# EAGLE schematic p8x-bustest-card (EAGLE 9.6.2)
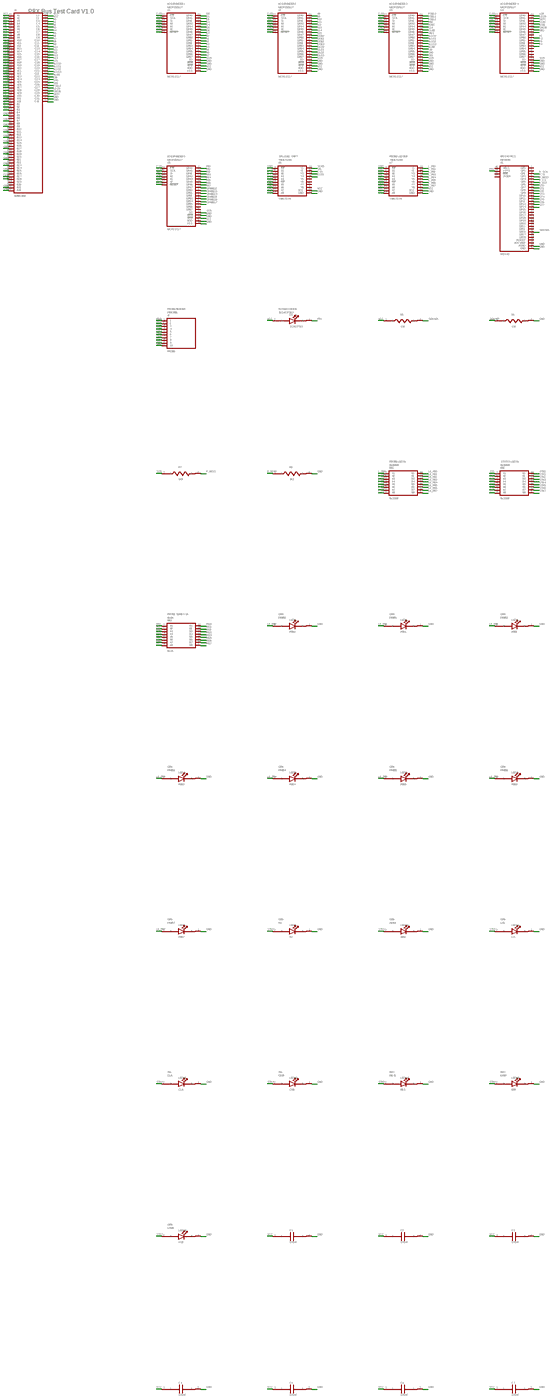
[diagram p0: schematic, sheet 1, overview]
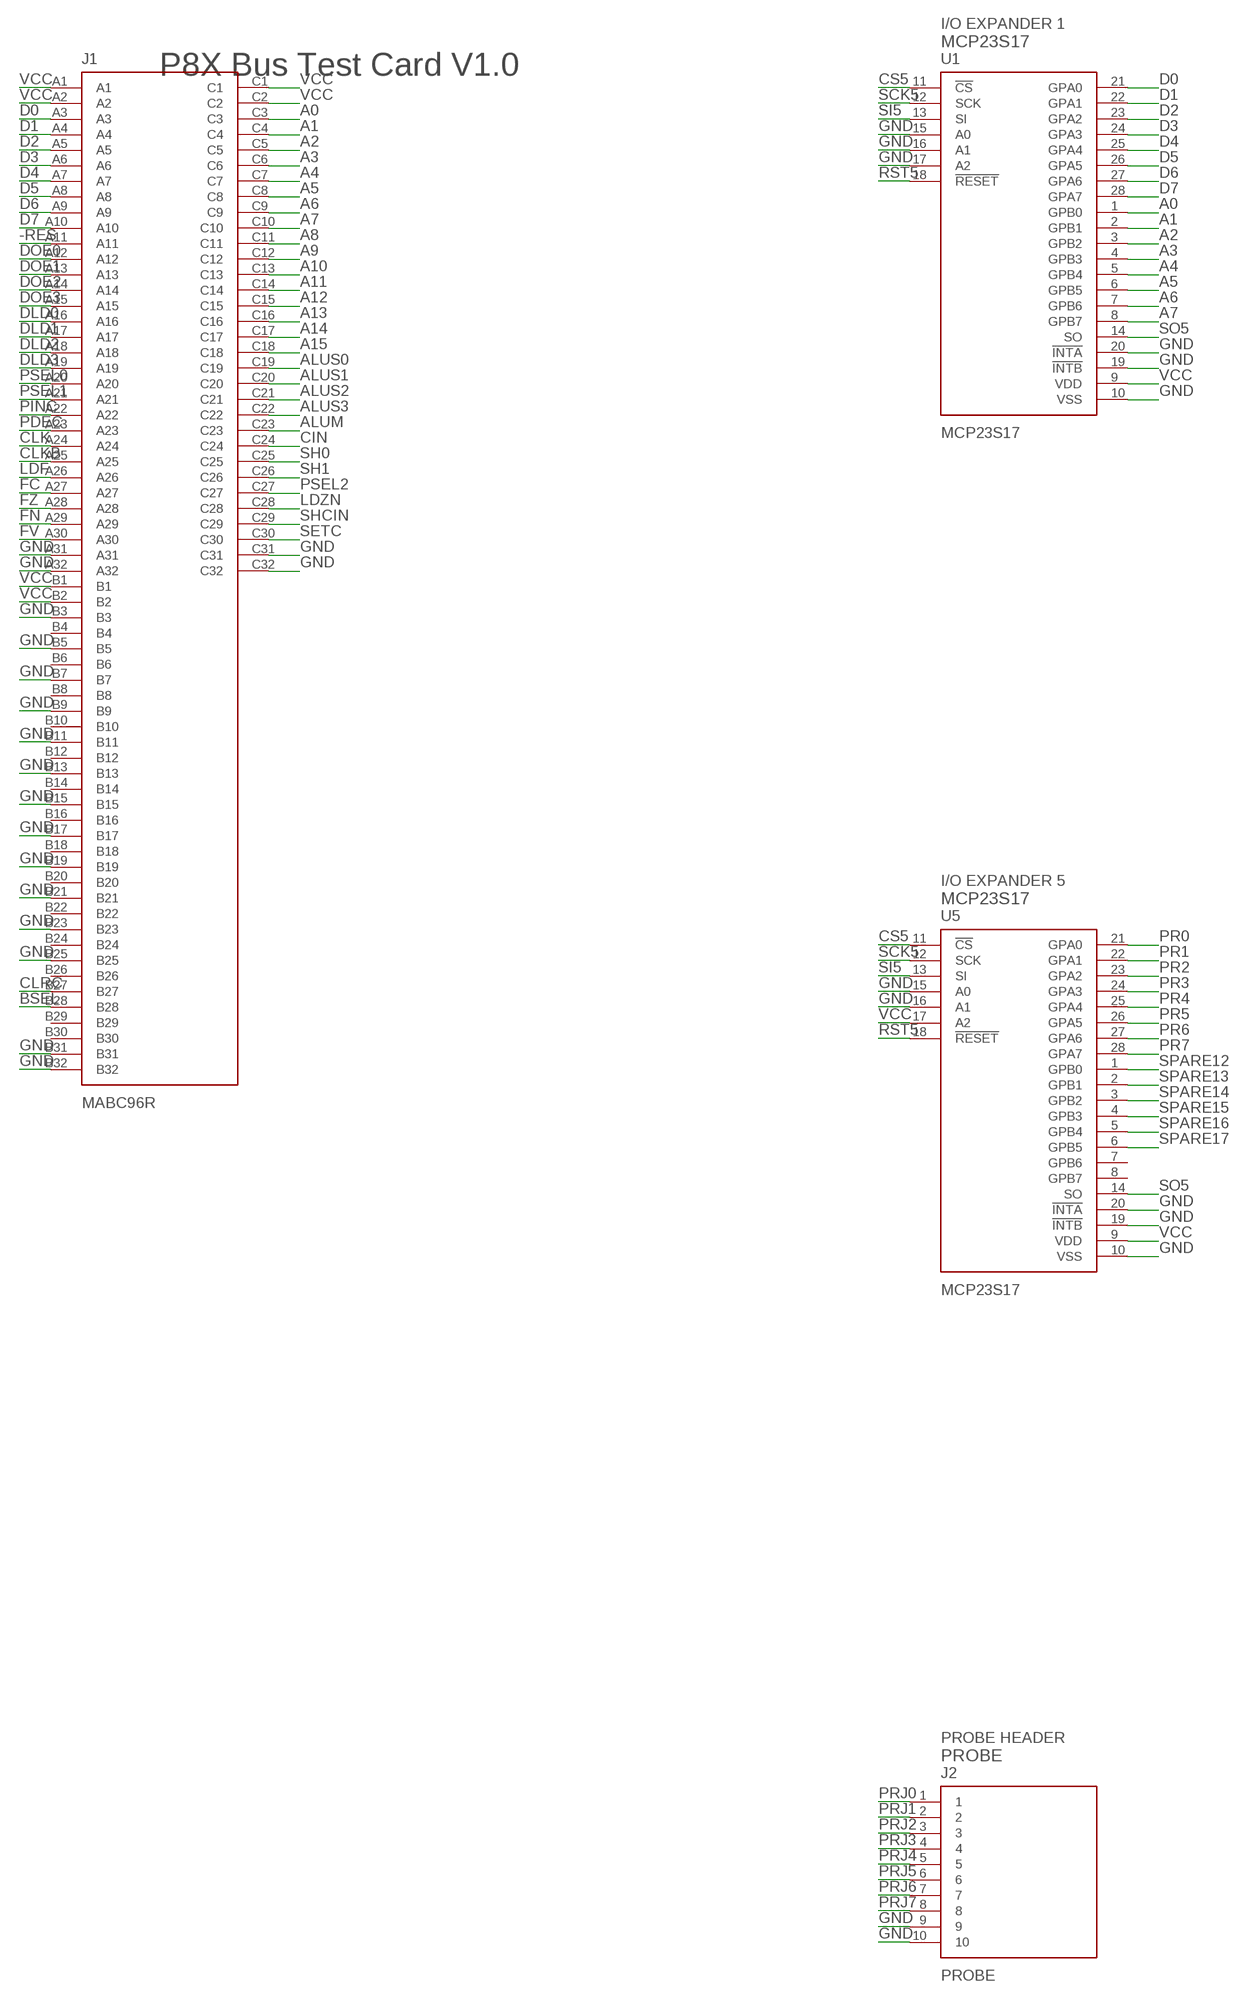
[diagram p1: schematic, sheet 1, part 1 of 5]
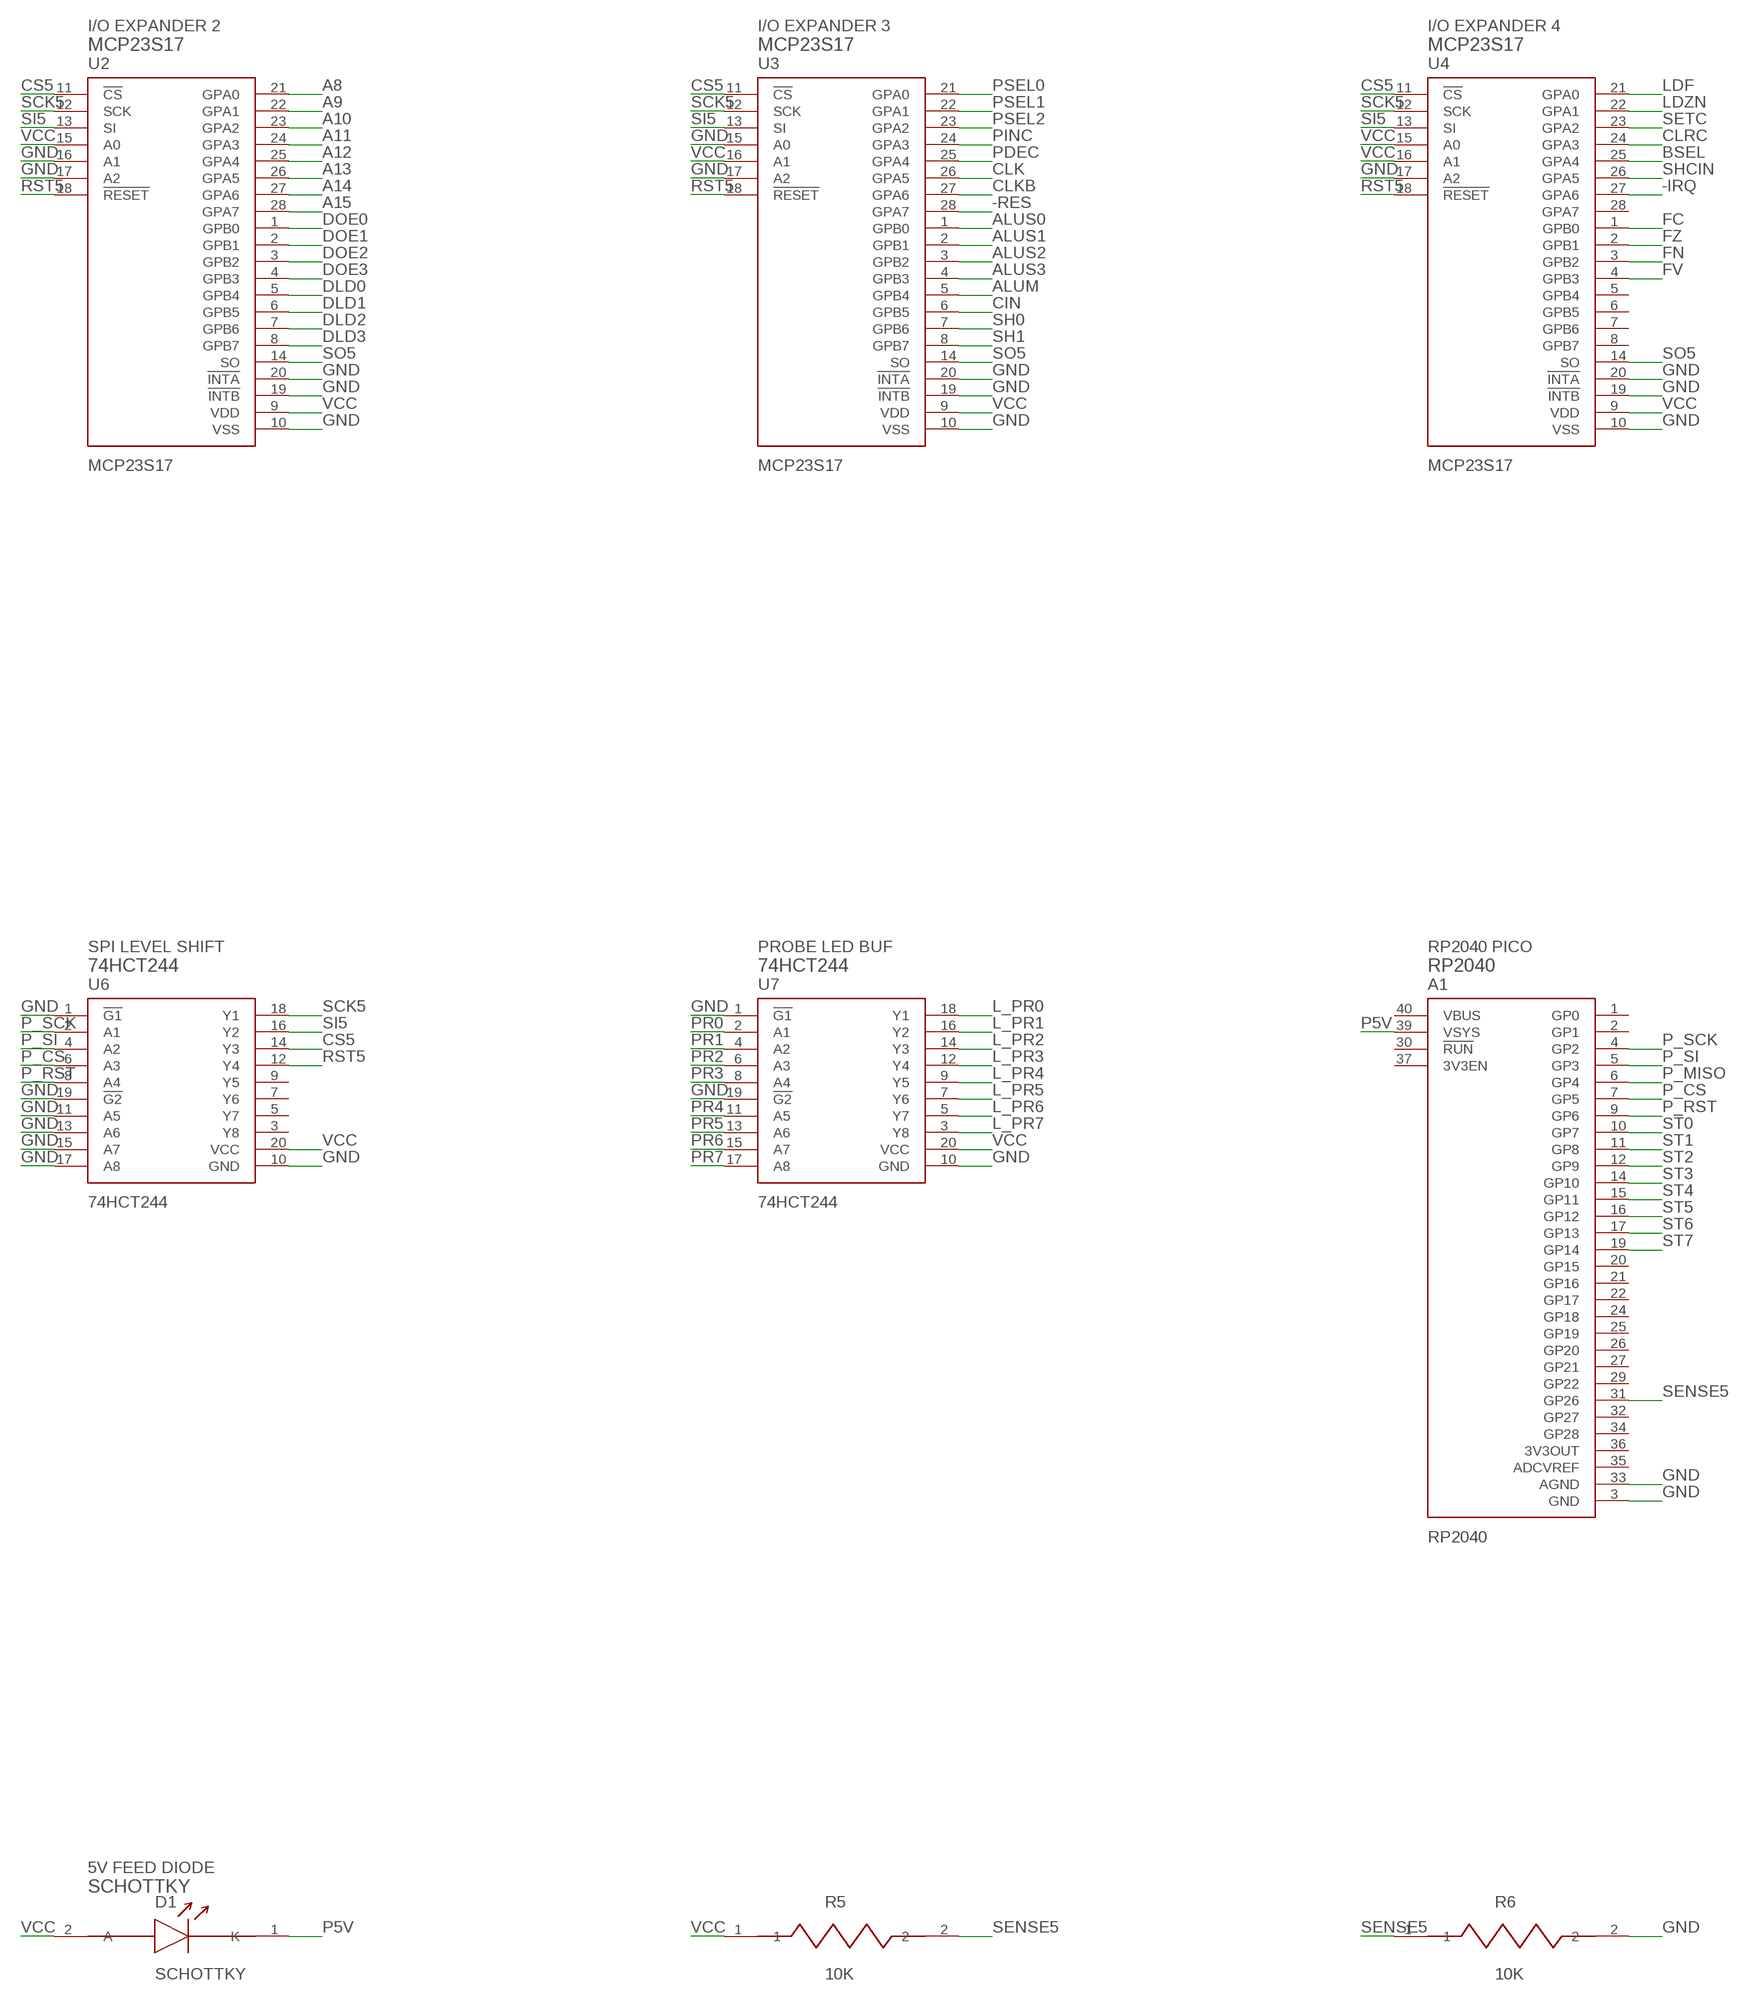
[diagram p2: schematic, sheet 1, part 2 of 5]
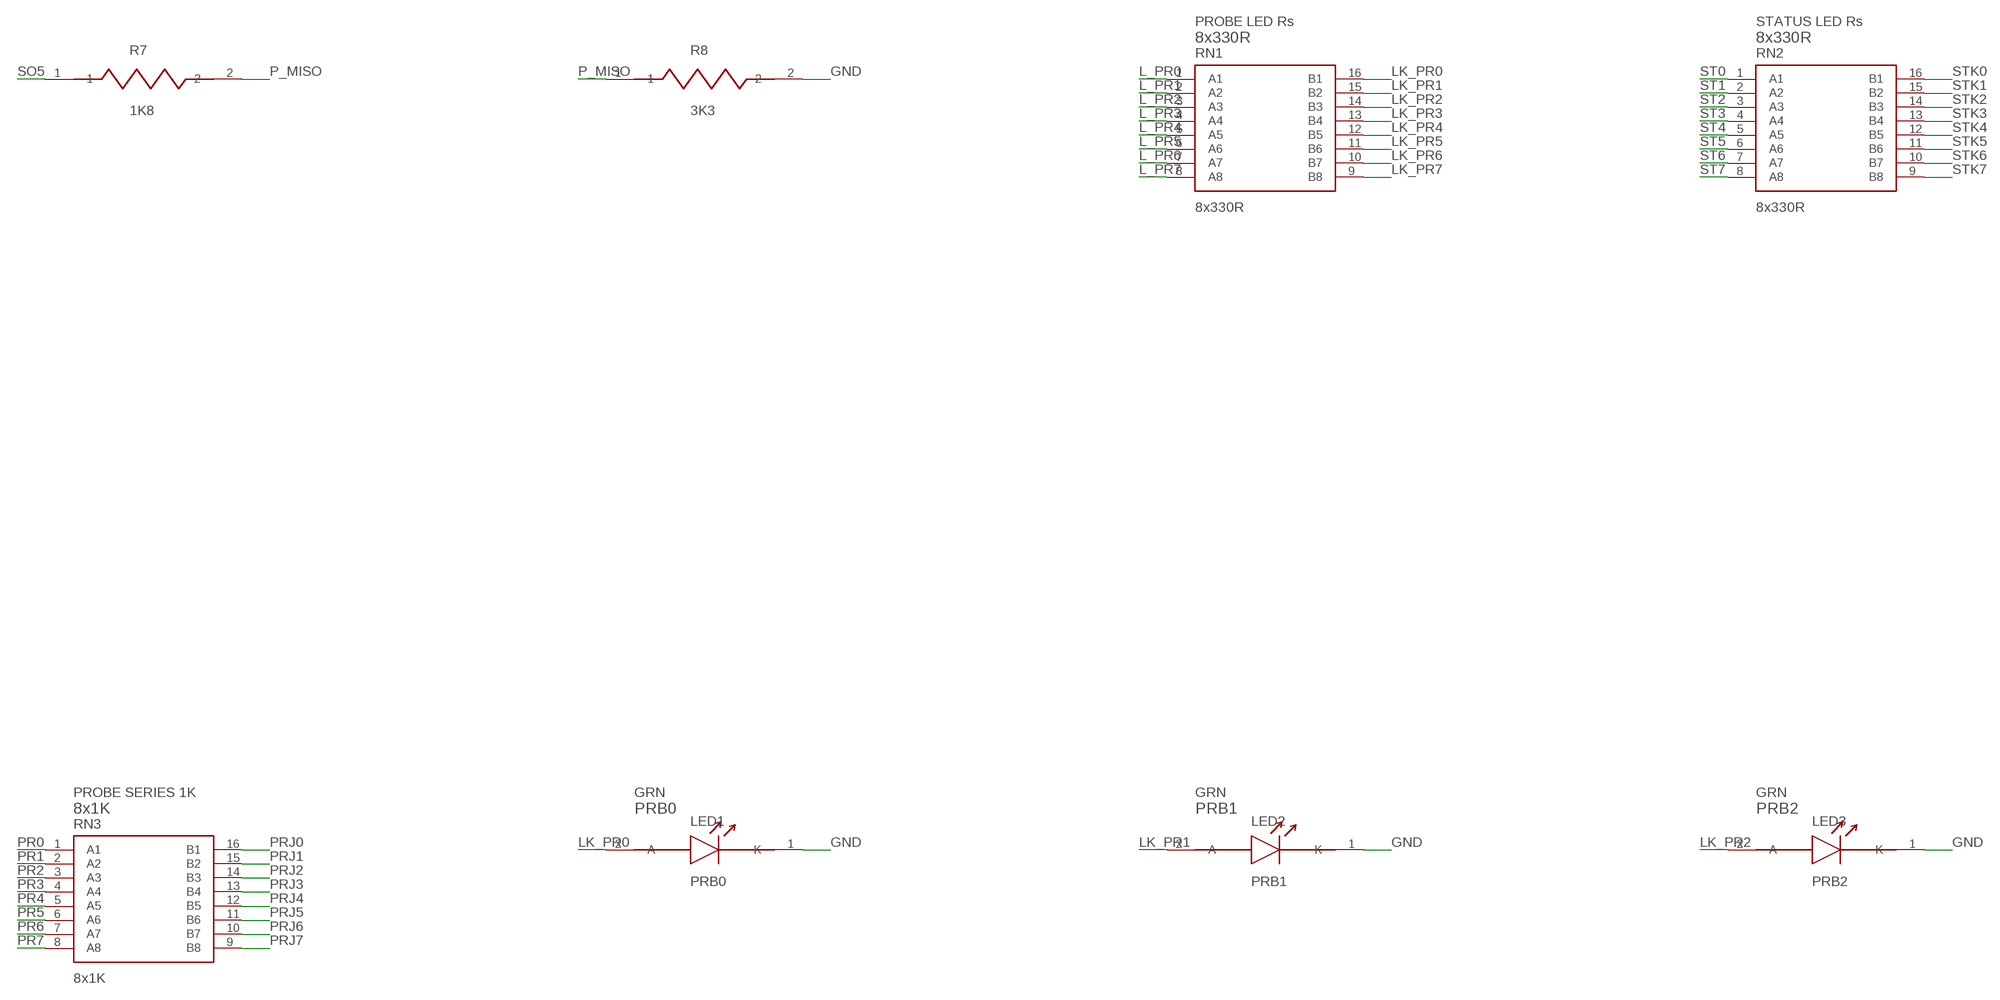
[diagram p3: schematic, sheet 1, part 3 of 5]
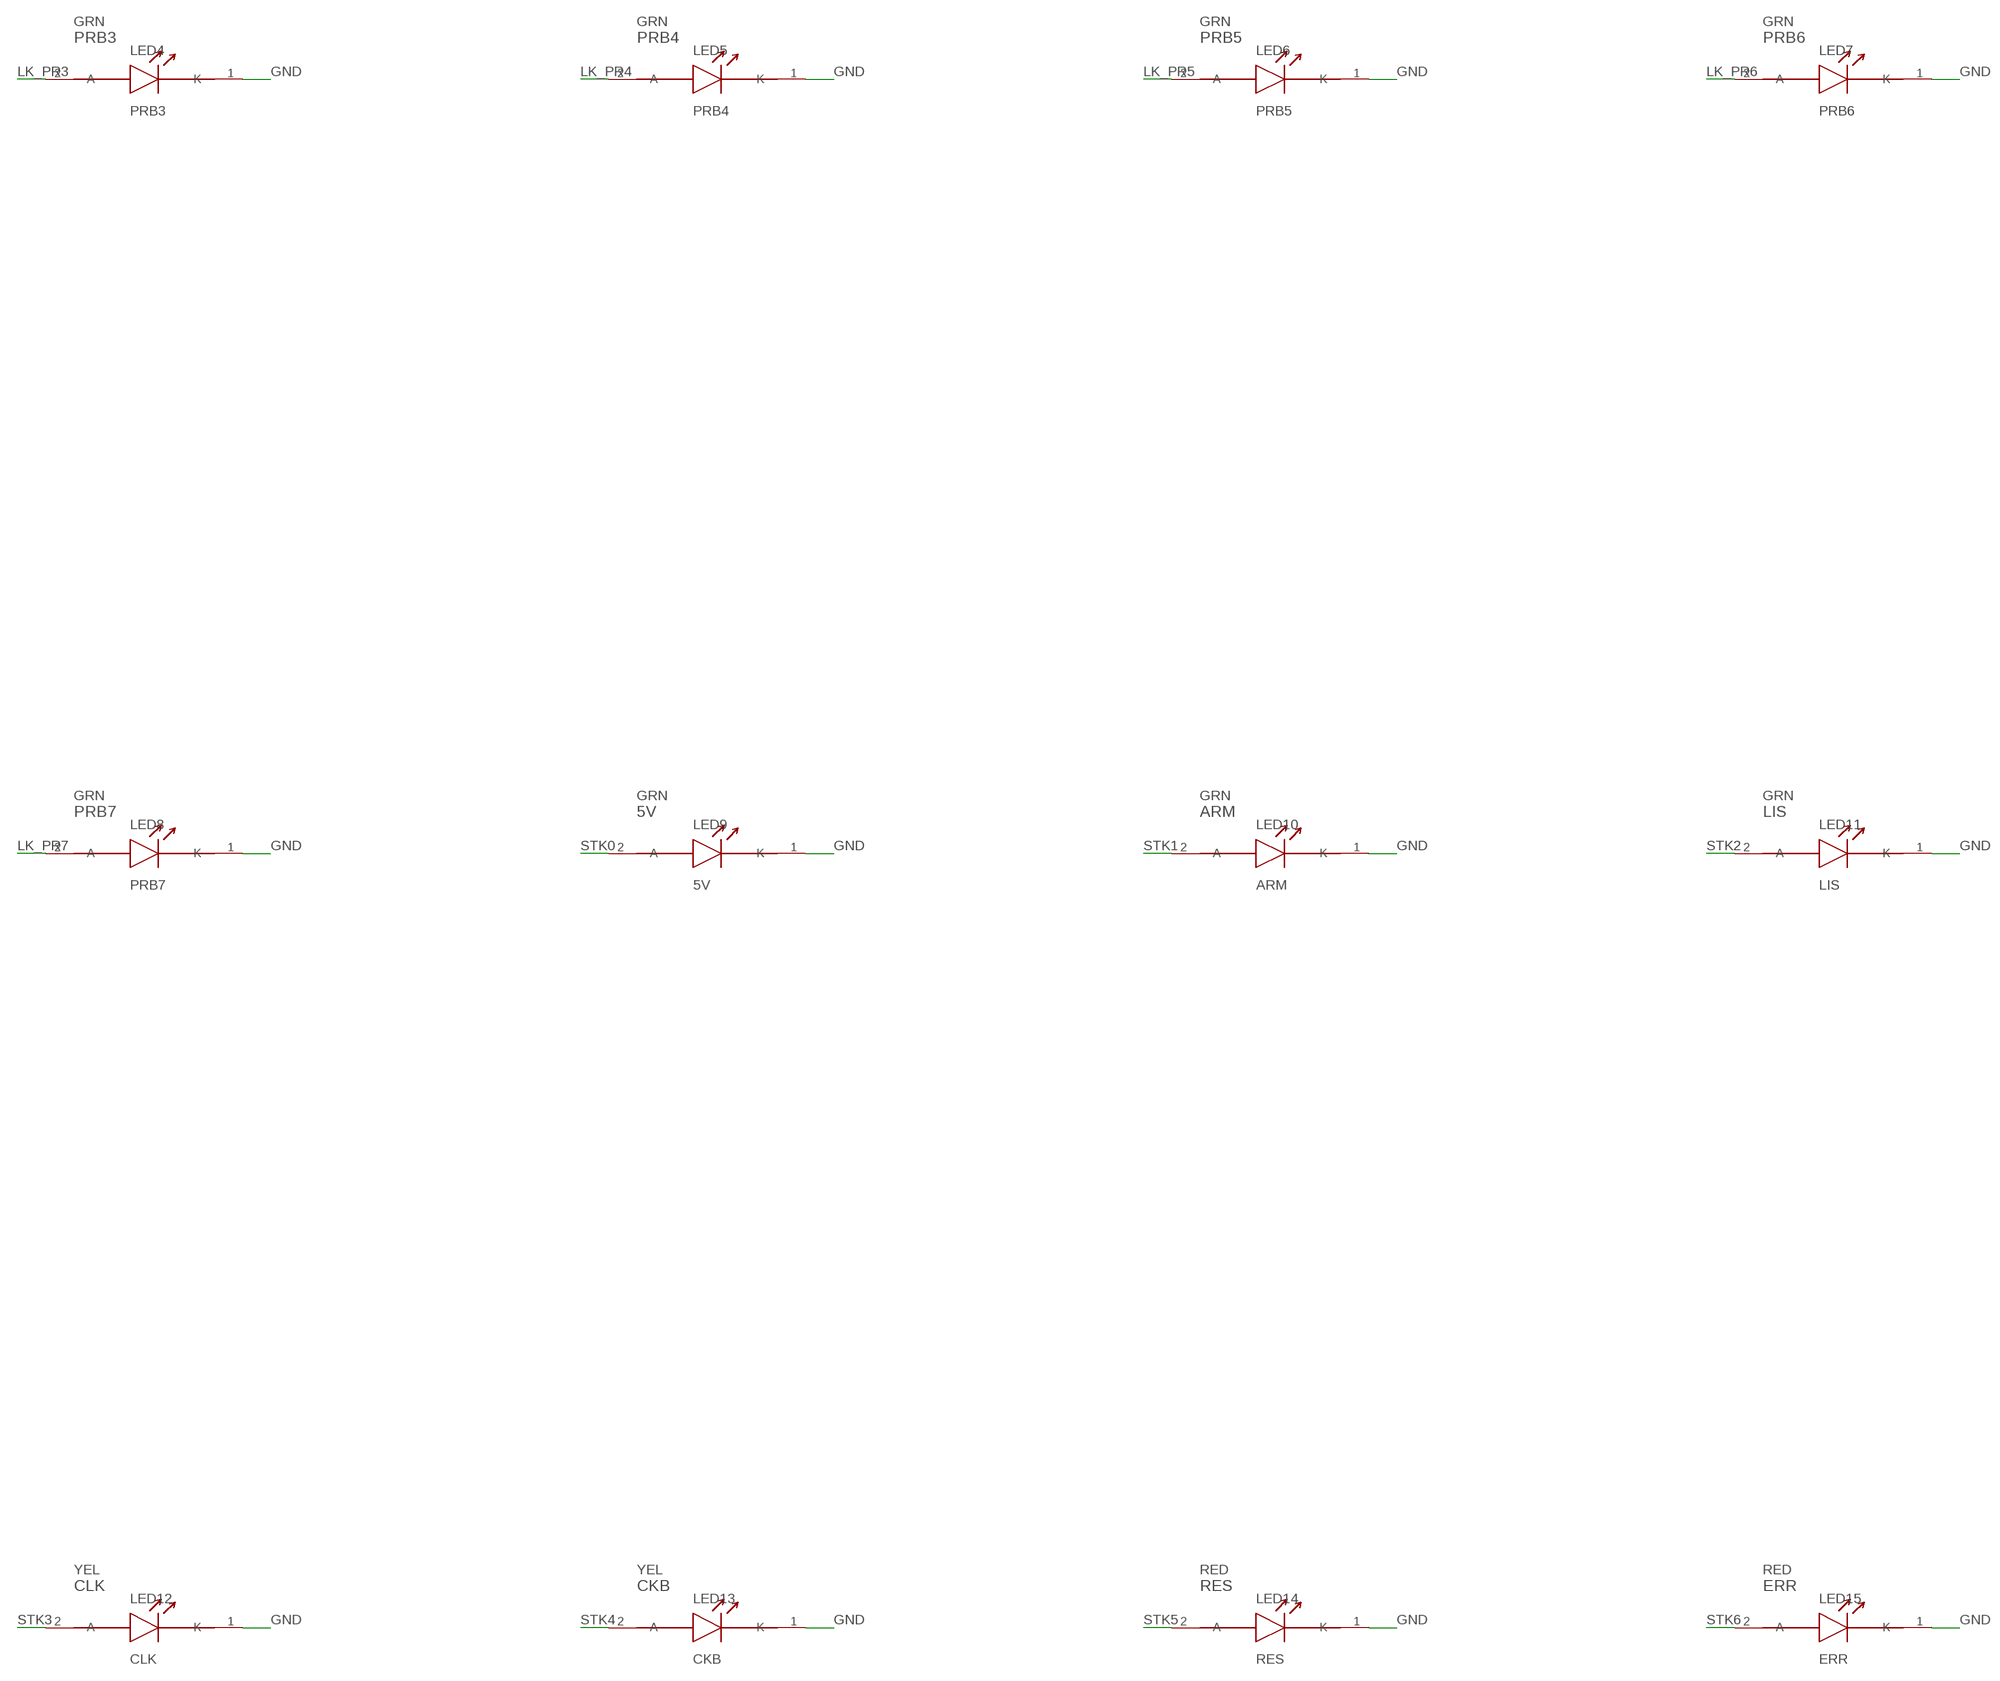
[diagram p4: schematic, sheet 1, part 4 of 5]
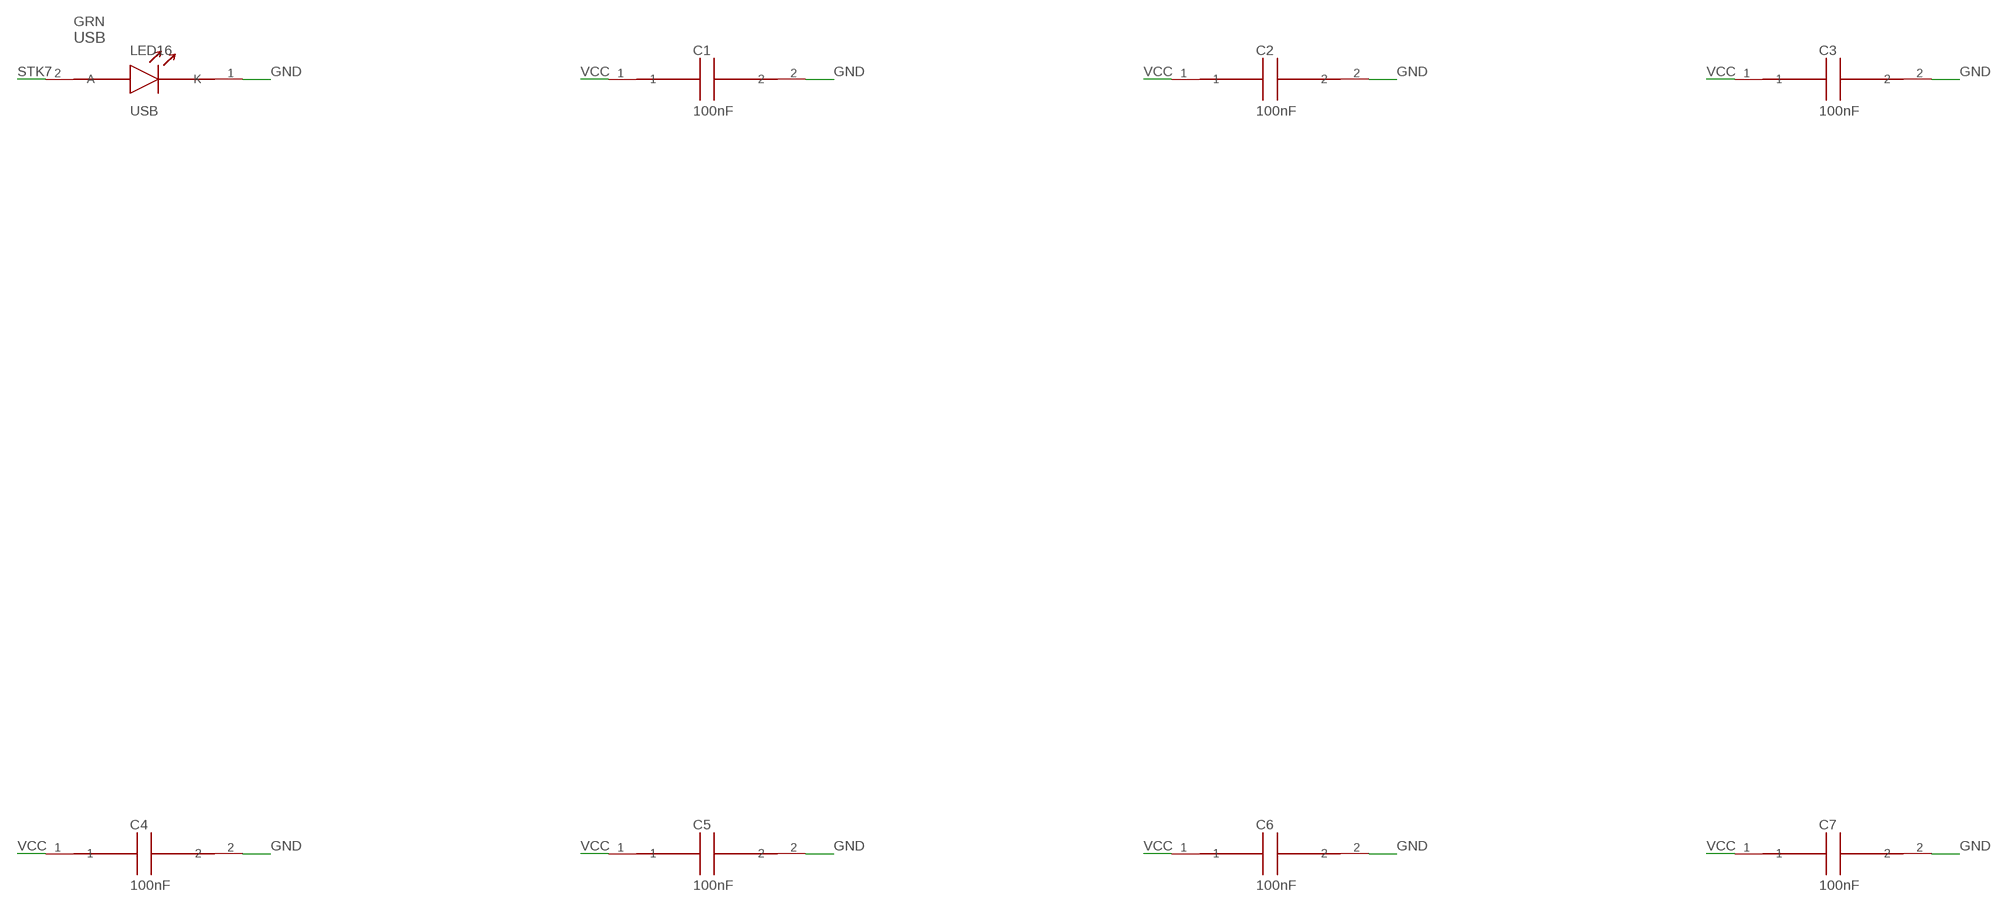
[diagram p5: schematic, sheet 1, part 5 of 5]

## Parts
A1  RP2040  PICO  [PICO40]
C1  100nF  CAP1  [C_DISC1]
C2  100nF  CAP1  [C_DISC1]
C3  100nF  CAP1  [C_DISC1]
C4  100nF  CAP1  [C_DISC1]
C5  100nF  CAP1  [C_DISC1]
C6  100nF  CAP1  [C_DISC1]
C7  100nF  CAP1  [C_DISC1]
D1  SCHOTTKY  LED  [LED5]
J1  MABC96R  DIN96C  [MABC96R]
J2  PROBE  HDR10  [HDR10]
LED1  PRB0  LED  [LED5]
LED2  PRB1  LED  [LED5]
LED3  PRB2  LED  [LED5]
LED4  PRB3  LED  [LED5]
LED5  PRB4  LED  [LED5]
LED6  PRB5  LED  [LED5]
LED7  PRB6  LED  [LED5]
LED8  PRB7  LED  [LED5]
LED9  5V  LED  [LED5]
LED10  ARM  LED  [LED5]
LED11  LIS  LED  [LED5]
LED12  CLK  LED  [LED5]
LED13  CKB  LED  [LED5]
LED14  RES  LED  [LED5]
LED15  ERR  LED  [LED5]
LED16  USB  LED  [LED5]
R5  10K  RES  [R_AXIAL]
R6  10K  RES  [R_AXIAL]
R7  1K8  RES  [R_AXIAL]
R8  3K3  RES  [R_AXIAL]
RN1  8x330R  RNISO8D  [DIP16]
RN2  8x330R  RNISO8D  [DIP16]
RN3  8x1K  RNISO8D  [DIP16]
U1  MCP23S17  [DIP28N]
U2  MCP23S17  [DIP28N]
U3  MCP23S17  [DIP28N]
U4  MCP23S17  [DIP28N]
U5  MCP23S17  [DIP28N]
U6  74HCT244  74244  [DIP20]
U7  74HCT244  74244  [DIP20]

## Nets
-IRQ: U4.27(GPA6)
-RES: J1.A11 U3.28(GPA7)
A0: J1.C3 U1.1(GPB0)
A1: J1.C4 U1.2(GPB1)
A2: J1.C5 U1.3(GPB2)
A3: J1.C6 U1.4(GPB3)
A4: J1.C7 U1.5(GPB4)
A5: J1.C8 U1.6(GPB5)
A6: J1.C9 U1.7(GPB6)
A7: J1.C10 U1.8(GPB7)
A8: J1.C11 U2.21(GPA0)
A9: J1.C12 U2.22(GPA1)
A10: J1.C13 U2.23(GPA2)
A11: J1.C14 U2.24(GPA3)
A12: J1.C15 U2.25(GPA4)
A13: J1.C16 U2.26(GPA5)
A14: J1.C17 U2.27(GPA6)
A15: J1.C18 U2.28(GPA7)
ALUM: J1.C23 U3.5(GPB4)
ALUS0: J1.C19 U3.1(GPB0)
ALUS1: J1.C20 U3.2(GPB1)
ALUS2: J1.C21 U3.3(GPB2)
ALUS3: J1.C22 U3.4(GPB3)
BSEL: J1.B28 U4.25(GPA4)
CIN: J1.C24 U3.6(GPB5)
CLK: J1.A24 U3.26(GPA5)
CLKB: J1.A25 U3.27(GPA6)
CLRC: J1.B27 U4.24(GPA3)
CS5: U1.11(!CS) U2.11(!CS) U3.11(!CS) U4.11(!CS) U5.11(!CS) U6.14(Y3)
D0: J1.A3 U1.21(GPA0)
D1: J1.A4 U1.22(GPA1)
D2: J1.A5 U1.23(GPA2)
D3: J1.A6 U1.24(GPA3)
D4: J1.A7 U1.25(GPA4)
D5: J1.A8 U1.26(GPA5)
D6: J1.A9 U1.27(GPA6)
D7: J1.A10 U1.28(GPA7)
DLD0: J1.A16 U2.5(GPB4)
DLD1: J1.A17 U2.6(GPB5)
DLD2: J1.A18 U2.7(GPB6)
DLD3: J1.A19 U2.8(GPB7)
DOE0: J1.A12 U2.1(GPB0)
DOE1: J1.A13 U2.2(GPB1)
DOE2: J1.A14 U2.3(GPB2)
DOE3: J1.A15 U2.4(GPB3)
FC: J1.A27 U4.1(GPB0)
FN: J1.A29 U4.3(GPB2)
FV: J1.A30 U4.4(GPB3)
FZ: J1.A28 U4.2(GPB1)
GND: A1.3(GND) A1.33(AGND) C1.2 C2.2 C3.2 C4.2 C5.2 C6.2 C7.2 J1.A31 J1.A32 J1.B3 J1.B5 J1.B7 J1.B9 J1.B11 J1.B13 J1.B15 J1.B17 J1.B19 J1.B21 J1.B23 J1.B25 J1.B31 J1.B32 J1.C31 J1.C32 J2.9 J2.10 LED1.1(K) LED2.1(K) LED3.1(K) LED4.1(K) LED5.1(K) LED6.1(K) LED7.1(K) LED8.1(K) LED9.1(K) LED10.1(K) LED11.1(K) LED12.1(K) LED13.1(K) LED14.1(K) LED15.1(K) LED16.1(K) R6.2 R8.2 U1.10(VSS) U1.15(A0) U1.16(A1) U1.17(A2) U1.19(!INTB) U1.20(!INTA) U2.10(VSS) U2.16(A1) U2.17(A2) U2.19(!INTB) U2.20(!INTA) U3.10(VSS) U3.15(A0) U3.17(A2) U3.19(!INTB) U3.20(!INTA) U4.10(VSS) U4.17(A2) U4.19(!INTB) U4.20(!INTA) U5.10(VSS) U5.15(A0) U5.16(A1) U5.19(!INTB) U5.20(!INTA) U6.1(!G1) U6.10(GND) U6.11(A5) U6.13(A6) U6.15(A7) U6.17(A8) U6.19(!G2) U7.1(!G1) U7.10(GND) U7.19(!G2)
L_PR0: RN1.1(A1) U7.18(Y1)
L_PR1: RN1.2(A2) U7.16(Y2)
L_PR2: RN1.3(A3) U7.14(Y3)
L_PR3: RN1.4(A4) U7.12(Y4)
L_PR4: RN1.5(A5) U7.9(Y5)
L_PR5: RN1.6(A6) U7.7(Y6)
L_PR6: RN1.7(A7) U7.5(Y7)
L_PR7: RN1.8(A8) U7.3(Y8)
LDF: J1.A26 U4.21(GPA0)
LDZN: J1.C28 U4.22(GPA1)
LK_PR0: LED1.2(A) RN1.16(B1)
LK_PR1: LED2.2(A) RN1.15(B2)
LK_PR2: LED3.2(A) RN1.14(B3)
LK_PR3: LED4.2(A) RN1.13(B4)
LK_PR4: LED5.2(A) RN1.12(B5)
LK_PR5: LED6.2(A) RN1.11(B6)
LK_PR6: LED7.2(A) RN1.10(B7)
LK_PR7: LED8.2(A) RN1.9(B8)
P5V: A1.39(VSYS) D1.1(K)
P_CS: A1.7(GP5) U6.6(A3)
P_MISO: A1.6(GP4) R7.2 R8.1
P_RST: A1.9(GP6) U6.8(A4)
P_SCK: A1.4(GP2) U6.2(A1)
P_SI: A1.5(GP3) U6.4(A2)
PDEC: J1.A23 U3.25(GPA4)
PINC: J1.A22 U3.24(GPA3)
PR0: RN3.1(A1) U5.21(GPA0) U7.2(A1)
PR1: RN3.2(A2) U5.22(GPA1) U7.4(A2)
PR2: RN3.3(A3) U5.23(GPA2) U7.6(A3)
PR3: RN3.4(A4) U5.24(GPA3) U7.8(A4)
PR4: RN3.5(A5) U5.25(GPA4) U7.11(A5)
PR5: RN3.6(A6) U5.26(GPA5) U7.13(A6)
PR6: RN3.7(A7) U5.27(GPA6) U7.15(A7)
PR7: RN3.8(A8) U5.28(GPA7) U7.17(A8)
PRJ0: J2.1 RN3.16(B1)
PRJ1: J2.2 RN3.15(B2)
PRJ2: J2.3 RN3.14(B3)
PRJ3: J2.4 RN3.13(B4)
PRJ4: J2.5 RN3.12(B5)
PRJ5: J2.6 RN3.11(B6)
PRJ6: J2.7 RN3.10(B7)
PRJ7: J2.8 RN3.9(B8)
PSEL0: J1.A20 U3.21(GPA0)
PSEL1: J1.A21 U3.22(GPA1)
PSEL2: J1.C27 U3.23(GPA2)
RST5: U1.18(!RESET) U2.18(!RESET) U3.18(!RESET) U4.18(!RESET) U5.18(!RESET) U6.12(Y4)
SCK5: U1.12(SCK) U2.12(SCK) U3.12(SCK) U4.12(SCK) U5.12(SCK) U6.18(Y1)
SENSE5: A1.31(GP26) R5.2 R6.1
SETC: J1.C30 U4.23(GPA2)
SH0: J1.C25 U3.7(GPB6)
SH1: J1.C26 U3.8(GPB7)
SHCIN: J1.C29 U4.26(GPA5)
SI5: U1.13(SI) U2.13(SI) U3.13(SI) U4.13(SI) U5.13(SI) U6.16(Y2)
SO5: R7.1 U1.14(SO) U2.14(SO) U3.14(SO) U4.14(SO) U5.14(SO)
SPARE12: U5.1(GPB0)
SPARE13: U5.2(GPB1)
SPARE14: U5.3(GPB2)
SPARE15: U5.4(GPB3)
SPARE16: U5.5(GPB4)
SPARE17: U5.6(GPB5)
ST0: A1.10(GP7) RN2.1(A1)
ST1: A1.11(GP8) RN2.2(A2)
ST2: A1.12(GP9) RN2.3(A3)
ST3: A1.14(GP10) RN2.4(A4)
ST4: A1.15(GP11) RN2.5(A5)
ST5: A1.16(GP12) RN2.6(A6)
ST6: A1.17(GP13) RN2.7(A7)
ST7: A1.19(GP14) RN2.8(A8)
STK0: LED9.2(A) RN2.16(B1)
STK1: LED10.2(A) RN2.15(B2)
STK2: LED11.2(A) RN2.14(B3)
STK3: LED12.2(A) RN2.13(B4)
STK4: LED13.2(A) RN2.12(B5)
STK5: LED14.2(A) RN2.11(B6)
STK6: LED15.2(A) RN2.10(B7)
STK7: LED16.2(A) RN2.9(B8)
VCC: C1.1 C2.1 C3.1 C4.1 C5.1 C6.1 C7.1 D1.2(A) J1.A1 J1.A2 J1.B1 J1.B2 J1.C1 J1.C2 R5.1 U1.9(VDD) U2.9(VDD) U2.15(A0) U3.9(VDD) U3.16(A1) U4.9(VDD) U4.15(A0) U4.16(A1) U5.9(VDD) U5.17(A2) U6.20(VCC) U7.20(VCC)
Unconnected: A1.1(GP0) A1.2(GP1) A1.20(GP15) A1.21(GP16) A1.22(GP17) A1.24(GP18) A1.25(GP19) A1.26(GP20) A1.27(GP21) A1.29(GP22) A1.30(!RUN) A1.32(GP27) A1.34(GP28) A1.35(ADCVREF) A1.36(3V3OUT) A1.37(3V3EN) A1.40(VBUS) J1.B4 J1.B6 J1.B8 J1.B10 J1.B12 J1.B14 J1.B16 J1.B18 J1.B20 J1.B22 J1.B24 J1.B26 J1.B29 J1.B30 U4.5(GPB4) U4.6(GPB5) U4.7(GPB6) U4.8(GPB7) U4.28(GPA7) U5.7(GPB6) U5.8(GPB7) U6.3(Y8) U6.5(Y7) U6.7(Y6) U6.9(Y5)

## Notes on the sheet
- I/O EXPANDER 1 | I/O EXPANDER 2 | I/O EXPANDER 3 | I/O EXPANDER 4
- MCP23S17 | MCP23S17 | MCP23S17 | MCP23S17
- P8X Bus Test Card V1.0
- I/O EXPANDER 5 | SPI LEVEL SHIFT | PROBE LED BUF | RP2040 PICO
- MCP23S17 | 74HCT244 | 74HCT244 | RP2040
- PROBE HEADER | 5V FEED DIODE
- PROBE | SCHOTTKY
- PROBE LED Rs | STATUS LED Rs
- 8x330R | 8x330R
- PROBE SERIES 1K | GRN | GRN | GRN
- 8x1K | PRB0 | PRB1 | PRB2
- GRN | GRN | GRN | GRN
- PRB3 | PRB4 | PRB5 | PRB6
- GRN | GRN | GRN | GRN
- PRB7 | 5V | ARM | LIS
- YEL | YEL | RED | RED
- CLK | CKB | RES | ERR
- GRN
- USB

## Library data of the parts
A1 = p8x:PICO
C1-C7 = p8x:CAP1
D1 LED1-LED16 = p8x:LED
J1 = p8x:DIN96C
J2 = p8x:HDR10
R5-R8 = p8x:RES
RN1-RN3 = p8x:RNISO8D
U1-U5 = p8x:MCP23S17
U6 U7 = p8x:74244